# EAGLE design prototype (EAGLE 7.4.0)
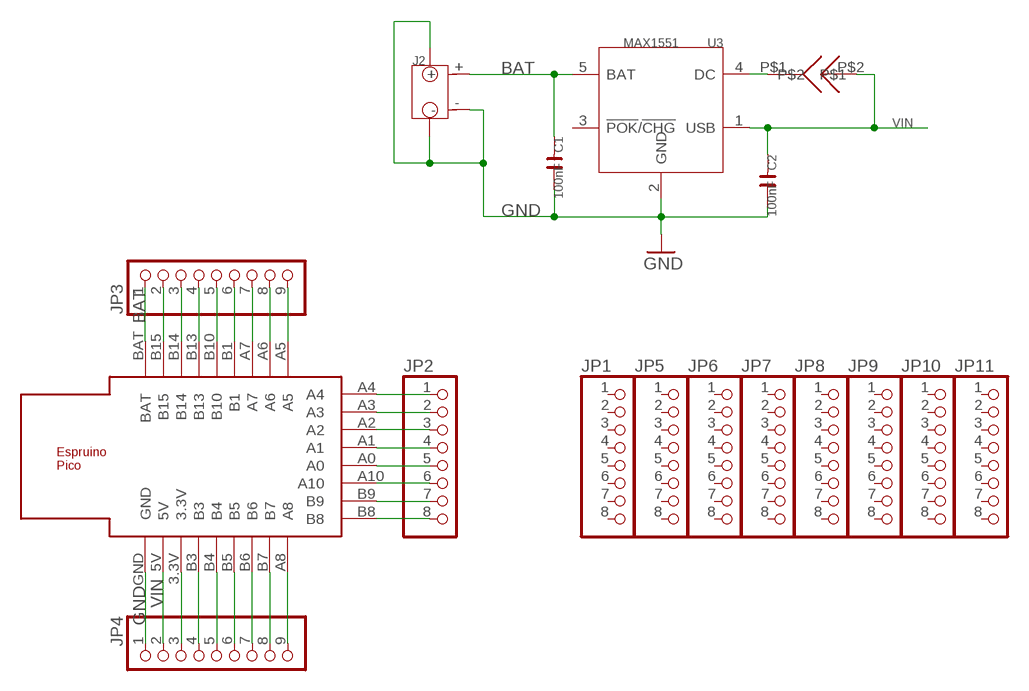
[diagram p0: schematic, sheet 1]

## Parts
C1  100nF  C-0603  [C0603]
C2  100nF  C-0603  [C0603]
J2  JST-2P-SMD-PW-3410050P1  [2P-SMD-2.0-90D]
JP1  PINHD-1X08_2.54-S  [1X08-S]
JP2  PINHD-1X08_2.54-S  [1X08-S]
JP3  PINHD-1X09_2.54-S  [1X09-S]
JP4  PINHD-1X09_2.54-S  [1X09-S]
JP5  PINHD-1X08_2.54-S  [1X08-S]
JP6  PINHD-1X08_2.54-S  [1X08-S]
JP7  PINHD-1X08_2.54-S  [1X08-S]
JP8  PINHD-1X08_2.54-S  [1X08-S]
JP9  PINHD-1X08_2.54-S  [1X08-S]
JP10  PINHD-1X08_2.54-S  [1X08-S]
JP11  PINHD-1X08_2.54-S  [1X08-S]
U3  MAX1551  [SOT23-5]
U$1  ESPRUINO_PICO_SMD  [ESPRUINO_PICO_SMD]
U$4  SOLDERJUMPER  [SOLDERJUMPER]

## Nets
BAT: C1.1 J2.+ JP3.1 U3.5(BAT) U$1.BAT
GND: C1.2 C2.2 J2.3 J2.4 J2.- JP4.1 U3.2(GND) U$1.GND
N$1: JP2.2 U$1.A3
N$2: JP2.3 U$1.A2
N$3: JP2.4 U$1.A1
N$4: JP2.5 U$1.A0
N$5: JP2.6 U$1.A10
N$6: JP2.7 U$1.B9
N$7: JP4.3 U$1.3.3V
N$8: JP4.4 U$1.B3
N$9: JP2.8 U$1.B8
N$10: JP4.5 U$1.B4
N$11: JP4.6 U$1.B5
N$12: JP4.7 U$1.B6
N$13: JP4.8 U$1.B7
N$14: JP4.9 U$1.A8
N$16: JP3.2 U$1.B15
N$17: JP3.3 U$1.B14
N$18: JP3.4 U$1.B13
N$19: JP3.5 U$1.B10
N$20: JP3.6 U$1.B1
N$21: JP3.7 U$1.A7
N$22: JP3.8 U$1.A6
N$23: JP3.9 U$1.A5
N$24: JP2.1 U$1.A4
N$25: U3.4(DC) U$4.P$1
VIN [power]: C2.1 JP4.2 U3.1(USB) U$1.5V U$4.P$2
Unconnected: JP1.1 JP1.2 JP1.3 JP1.4 JP1.5 JP1.6 JP1.7 JP1.8 JP5.1 JP5.2 JP5.3 JP5.4 JP5.5 JP5.6 JP5.7 JP5.8 JP6.1 JP6.2 JP6.3 JP6.4 JP6.5 JP6.6 JP6.7 JP6.8 JP7.1 JP7.2 JP7.3 JP7.4 JP7.5 JP7.6 JP7.7 JP7.8 JP8.1 JP8.2 JP8.3 JP8.4 JP8.5 JP8.6 JP8.7 JP8.8 JP9.1 JP9.2 JP9.3 JP9.4 JP9.5 JP9.6 JP9.7 JP9.8 JP10.1 JP10.2 JP10.3 JP10.4 JP10.5 JP10.6 JP10.7 JP10.8 JP11.1 JP11.2 JP11.3 JP11.4 JP11.5 JP11.6 JP11.7 JP11.8 U3.3(!POK!/!CHG!)

## Library data of the parts
C1 C2 = OPL5:C*
J2 = OPL Eagle Library:JST-2P-SMD-PW
JP1 JP2 JP5-JP11 = pinhead-2:PINHD-1X08: PIN HEADER
JP3 JP4 = pinhead-2:PINHD-1X09: PIN HEADER
U3 = template:MAX1551: SOT23 Dual-Input USB/AC Adapter 1-Cell Li+ Battery Chargers
U$1 = espruino_pico:ESPRUINO_PICO_SMD
U$4 = solder_jumper:SOLDERJUMPER

## Net classes
0 default: width 0.305 mm
1 power: width 0.406 mm

## Board
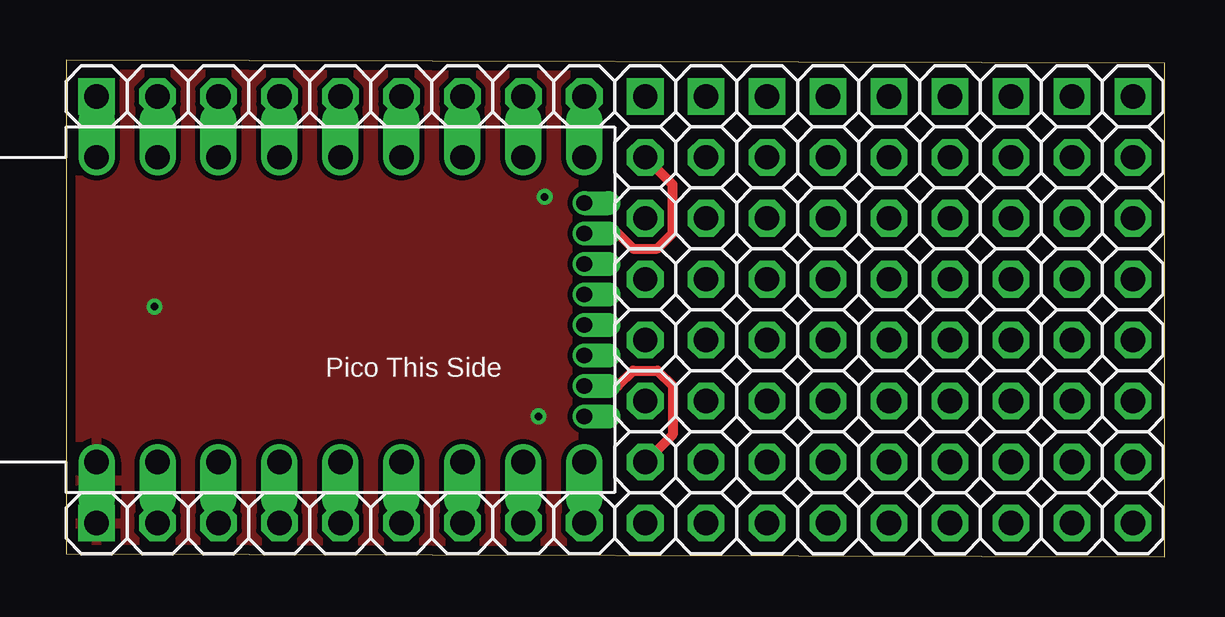
[diagram p1: board, top side]
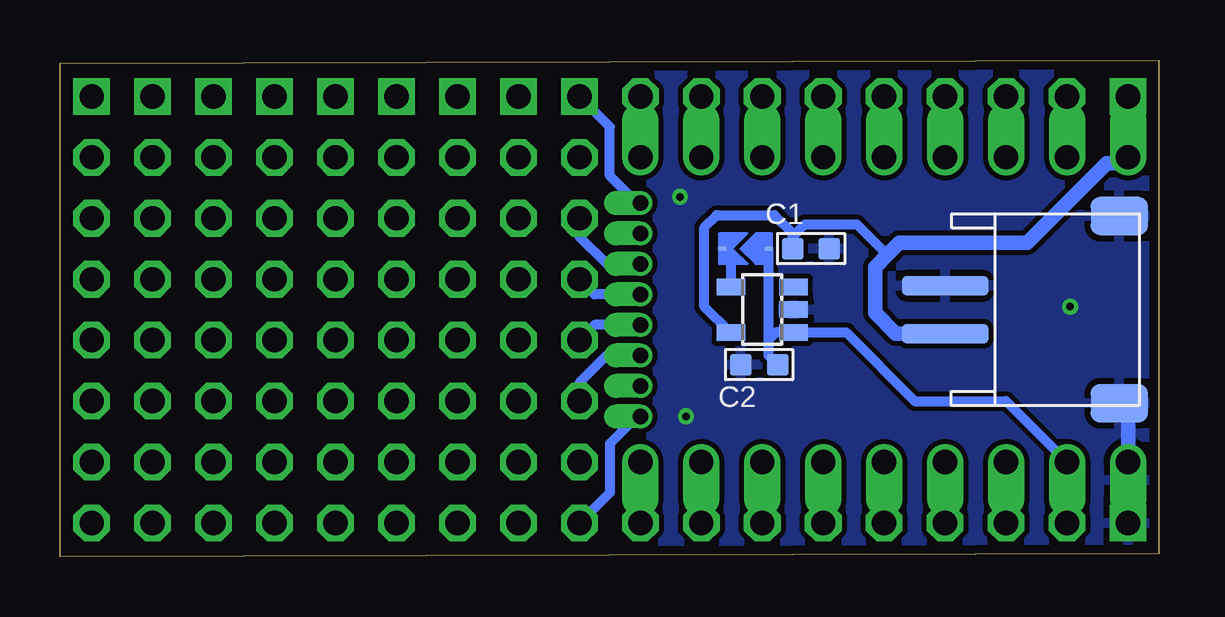
[diagram p2: board, bottom side, seen from below]

Size 45.77 x 20.69 mm. Coordinates in mm from the lower left corner, seen from the top.
Outline: 0,0.13 45.77,0 45.77,20.56 0,20.69 0,0.13
Copper layers (1*16): Top 0.0356mm / dielectric 1.5011mm / Bottom 0.0356mm
Design rules "oshpark": minimum track width 10mil, minimum drill 13mil, track to track 8mil, track to pad 6mil, pad to pad 6mil, via to via 6mil, smd to smd 6mil, copper to edge 15mil, drill to drill 6mil, minimum pad ring 7mil, minimum via ring 7mil, stop-mask expansion 4mil, vias tented up to drill 15mil, thermal gap 10mil

### Footprints (pad centres in the part's own frame; a part is rotated, then mirrored left to right if it is on the bottom)
C0603 = smd 0.889 x 0.889: 1 -0.762,0; 2 0.762,0
2P-SMD-2.0-90D = smd 1.6 x 2.4: 3 3.9,-2.181; 4 -3.9,-2.181 | smd 0.8 x 3.6: + -1,5.08; - 1,5.08
1X08-S = drill 1.016 square: 1 -8.89,0 | drill 1.016 octagon: 2 -6.35,0; 3 -3.81,0; 4 -1.27,0; 5 1.27,0; 6 3.81,0; 7 6.35,0; 8 8.89,0
1X09-S = drill 1.016 square: 1 -10.16,0 | drill 1.016 octagon: 2 -7.62,0; 3 -5.08,0; 4 -2.54,0; 5 0,0; 6 2.54,0; 7 5.08,0; 8 7.62,0; 9 10.16,0
SOT23-5 = smd 0.69 x 1.2: 1 -0.95,-1.3; 2 0,-1.3; 3 0.95,-1.3; 4 0.95,1.3; 5 -0.95,1.3
ESPRUINO_PICO_SMD = drill 1.016 offset: 3.3V -8.89,-6.35; 5V -11.43,-6.35; A5 6.35,6.35; A6 3.81,6.35; A7 1.27,6.35; A8 6.35,-6.35; B1 -1.27,6.35; B3 -6.35,-6.35; B4 -3.81,-6.35; B5 -1.27,-6.35; B6 1.27,-6.35; B7 3.81,-6.35; B10 -3.81,6.35; B13 -6.35,6.35; B14 -8.89,6.35; B15 -11.43,6.35; BAT -13.97,6.35; GND -13.97,-6.35 | drill 0.65 pad 0.965 offset: A0 6.35,-0.635; A1 6.35,0.635; A2 6.35,1.905; A3 6.35,3.175; A4 6.35,4.445; A10 6.35,-1.905; B8 6.35,-4.445; B9 6.35,-3.175
SOLDERJUMPER = smd 0.305 x 0.152: P$1 0.762,0; P$2 -1.143,0

### Placement (x,y rotation side)
C1  14.48,12.83 0 bottom
C2  16.64,8 180 bottom
J2  3.81,10.29 90 bottom
JP1  26.67,10.29 270 top
JP2  24.13,10.29 270 top
JP3  11.43,19.18 0 top
JP4  11.43,1.4 0 top
JP5  29.21,10.29 270 top
JP6  31.75,10.29 270 top
JP7  34.29,10.29 270 top
JP8  36.83,10.29 270 top
JP9  39.37,10.29 270 top
JP10  41.91,10.29 270 top
JP11  44.45,10.29 270 top
U3  16.51,10.29 90 bottom
U$1  15.24,10.29 0 top
U$4  17.4,12.83 180 bottom

### Tracks (layer width: path | path; a pad name or v marks a point on that pad's centre or on a via)
BAT
  Bottom 0.406: U3.5 17.85,9.34 18.92,10.41 18.92,13.72 18.41,14.22 16,14.22 15.24,13.46 C1.1 15.24,13.34 14.73,13.84 12.57,13.84 11.3,12.57
  Bottom 0.61: U$1.BAT 1.52,16.38 2.16,16.38 5.46,13.08 10.79,13.08 11.3,12.57 11.81,12.07 11.81,10.16 10.94,9.29 J2.+
  Bottom 1.016: U$1.BAT JP3.1
GND  (via drill 0.3)
  Bottom 0.61: U$1.GND 1.27,6.03
  Bottom 1.016: U$1.GND JP4.1
  other vias: 19.94,14.99 19.68,5.84 3.68,10.41
  pour Top: 0,20.45 45.72,20.45 45.72,0.13 0,-0.13
  pour Bottom: 0,20.45 45.72,20.45 45.72,0.13 0,0.13
N$1
  Top 0.406: U$1.A3 22.99,13.46 23.62,12.83 24.64,12.83 25.27,13.46 25.27,15.49 JP2.2
N$2
  Bottom 0.406: U$1.A2 22.99,12.19 24.13,13.34 JP2.3
N$3
  Bottom 0.406: U$1.A1 23.5,10.92 JP2.4
N$4
  Bottom 0.406: U$1.A0 23.5,9.65 JP2.5
N$5
  Bottom 0.406: U$1.A10 22.99,8.38 24.13,7.24 JP2.6
N$6
  Top 0.406: U$1.B9 22.99,7.11 23.62,7.75 24.64,7.75 25.27,7.11 25.27,5.08 JP2.7
N$7
  Bottom 1.016: U$1.3.3V JP4.3
N$8
  Bottom 1.016: U$1.B3 JP4.4
N$9
  Bottom 0.406: U$1.B8 21.72,5.84 22.86,4.7 22.86,2.67 JP2.8
N$10
  Bottom 1.016: U$1.B4 JP4.5
N$11
  Bottom 1.016: U$1.B5 JP4.6
N$12
  Bottom 1.016: U$1.B6 JP4.7
N$13
  Bottom 1.016: U$1.B7 JP4.8
N$14
  Bottom 1.016: U$1.A8 JP4.9
N$16
  Bottom 1.016: U$1.B15 JP3.2
N$17
  Bottom 1.016: U$1.B14 JP3.3
N$18
  Bottom 1.016: U$1.B13 JP3.4
N$19
  Bottom 1.016: U$1.B10 JP3.5
N$20
  Bottom 1.016: U$1.B1 JP3.6
N$21
  Bottom 1.016: U$1.A7 JP3.7
N$22
  Bottom 1.016: U$1.A6 JP3.8
N$23
  Bottom 1.016: U$1.A5 JP3.9
N$24
  Bottom 0.406: U$1.A4 21.72,14.73 22.86,15.88 22.86,17.91 JP2.1
N$25
  Bottom 0.406: U3.4 17.81,12.48 U$4.P$1
VIN
  Bottom 0.406: U$4.P$2 16.26,9.02 | 16.26,9.02 16.26,8.38 C2.1 | 16.26,9.02 15.94,9.34 U3.1 13.02,9.34 10.16,6.48 6.35,6.48 U$1.5V
  Bottom 1.016: U$1.5V JP4.2

### Text on the board
tNames: Pico This Side